# EAGLE design POE_RS-485 (EAGLE 6.4)
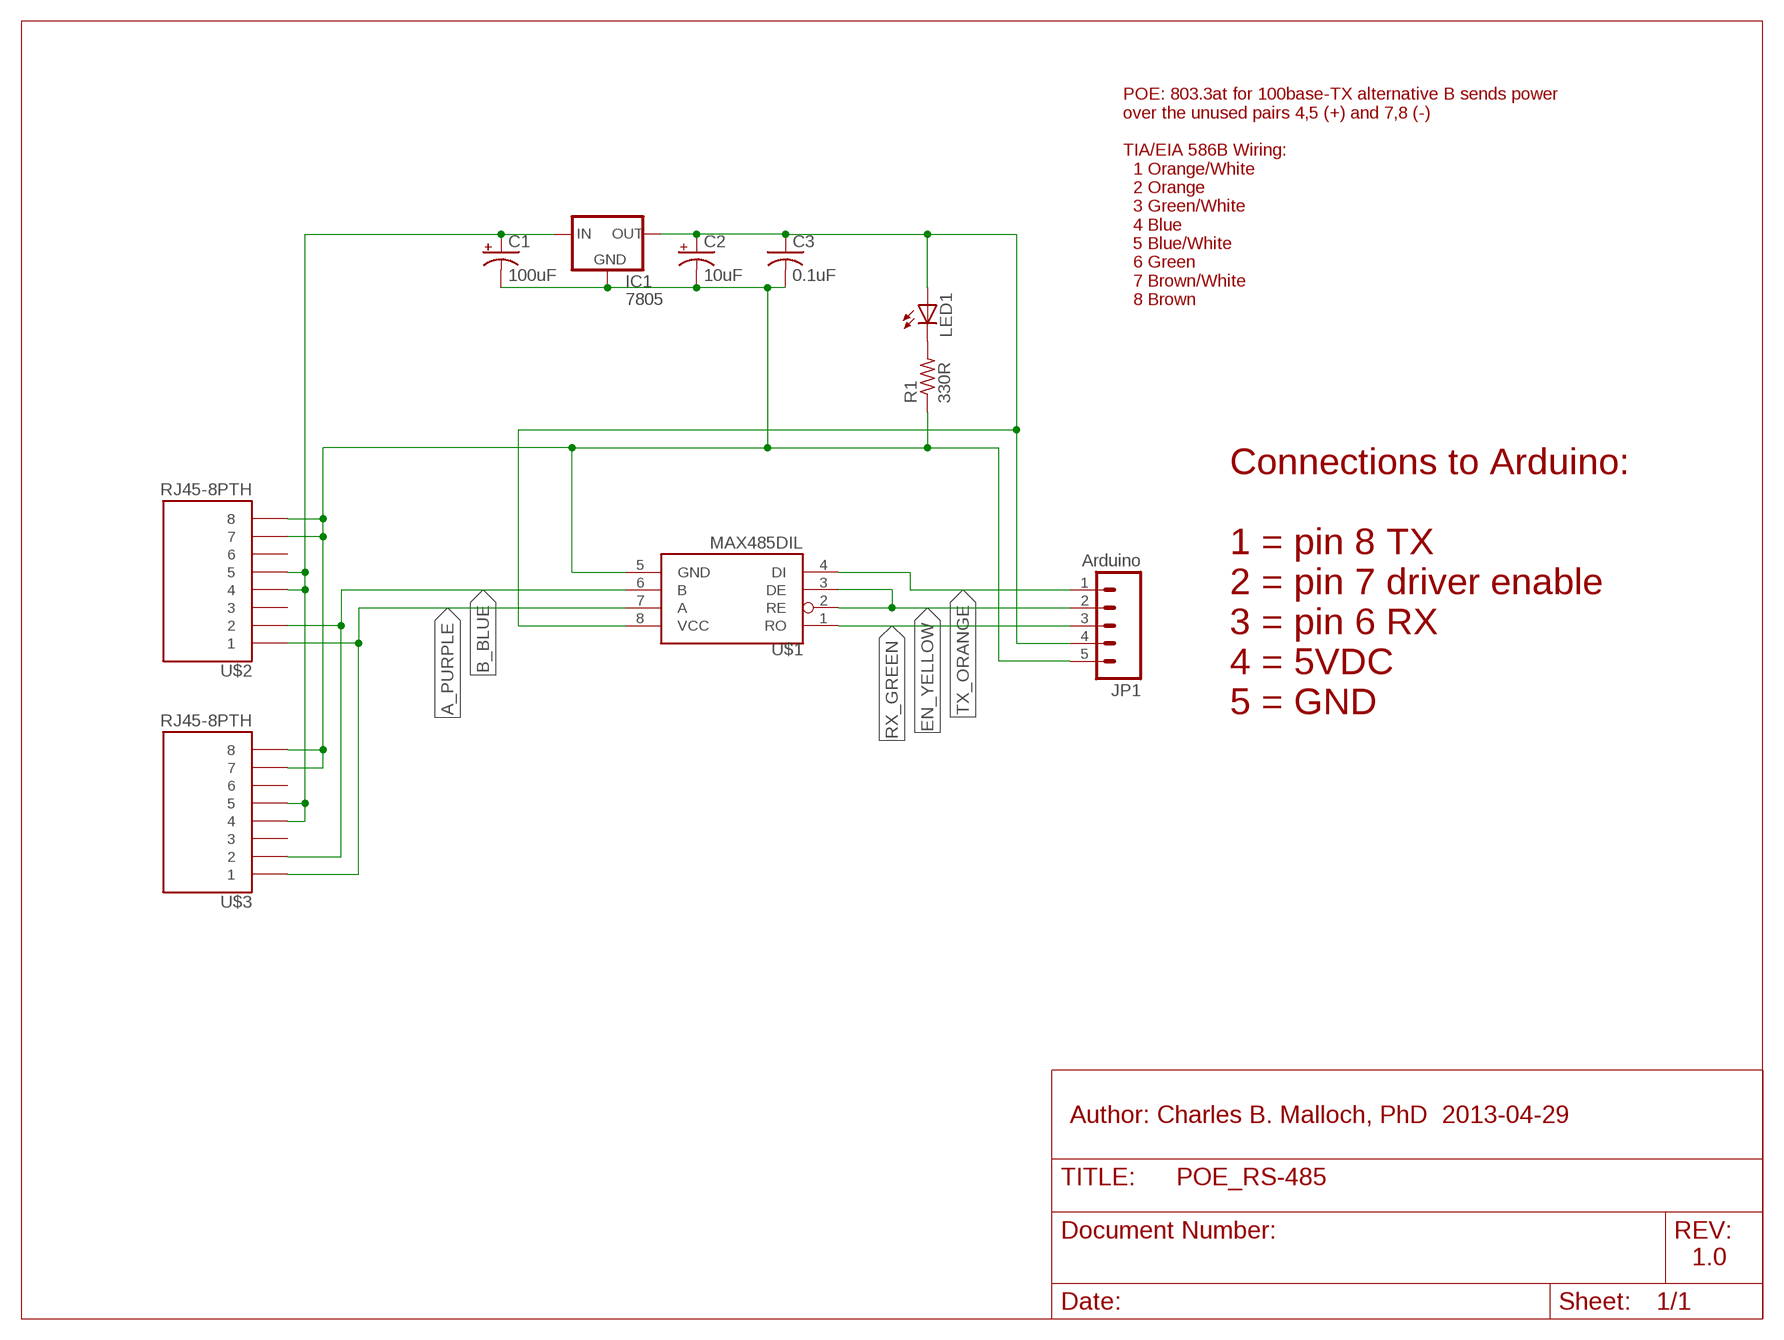
[diagram p0: schematic, sheet 1]

## Parts
C1  100uF  CPOL-USTT2D7  [TT2D7]
C2  10uF  CPOL-USE1.8-4  [E1,8-4]
C3  0.1uF  C-US025-025X050  [C025-025X050]
IC1  7805  V_REG_78XX-TO-220  [TO-220-ALT]
JP1  Arduino  M05LOCK_LONGPADS  [1X05_LOCK_LONGPADS]
LED1  LED3MM  [LED3MM]
R1  330R  R-US_0204/7  [0204/7]
U$1  MAX485DIL  [DIL08]
U$2  RJ45-8PTH  [RJ45-8]
U$3  RJ45-8PTH  [RJ45-8]

## Nets
A_PURPLE: U$1.7(A) U$2.1 U$3.1
B_BLUE: U$1.6(B) U$2.2 U$3.2
EN_YELLOW: JP1.2 U$1.2(RE) U$1.3(DE)
GND [POWER]: C1.- C2.- C3.2 IC1.GND JP1.5 R1.1 U$1.5(GND) U$2.7 U$2.8 U$3.7 U$3.8
N$1: LED1.K(C) R1.2
PWR [POWER]: C2.+ C3.1 IC1.OUT JP1.4 LED1.A U$1.8(VCC)
RX_GREEN: JP1.3 U$1.1(RO)
TX_ORANGE: JP1.1 U$1.4(DI)
VIN [POWER]: C1.+ IC1.IN U$2.4 U$2.5 U$3.4 U$3.5
Unconnected: U$2.3 U$2.6 U$3.3 U$3.6

## Notes on the sheet
- POE: 803.3at for 100base-TX alternative B sends power 
  over the unused pairs 4,5 (+) and 7,8 (-)
  
  TIA/EIA 586B Wiring:
    1 Orange/White
    2 Orange
    3 Green/White
    4 Blue
    5 Blue/White
    6 Green
    7 Brown/White
    8 Brown
- Connections to Arduino:
  
  1 = pin 8 TX
  2 = pin 7 driver enable
  3 = pin 6 RX
  4 = 5VDC
  5 = GND
- Author: Charles B. Malloch, PhD  2013-04-29
- 1.0

## Library data of the parts
C1 C2 = adafruit:CPOL-US: POLARIZED CAPACITOR, American symbol
C3 = adafruit:C-US: CAPACITOR, American symbol
IC1 = SparkFun-PowerIC:V_REG_78XX: Voltage Regulator Standard 7805 5V regulator. IGO (Input Ground Output). Spark Fun Electronics SKU : COM-00107
JP1 = SparkFun-Connectors:M05: Header 5 Standard 5-pin 0.1" header. Use with straight break away headers (SKU : PRT-00116), right angle break away headers (PRT-00553), swiss pins (PRT-00743), machine pins (PRT-00117), and female headers (PRT-00115). Molex polarized connector foot print use with SKU : PRT-08230 with associated crimp pins and housings.
LED1 = led:LED: LED OSRAM: - CHIPLED LG R971, LG N971, LY N971, LG Q971, LY Q971, LO R971, LY R971 LH N974, LH R974 LS Q976, LO Q976, LY Q976 LO Q996 - Hyper CHIPLED LW Q18S LB Q993, LB Q99A, LB R99A - SideLED LS A670, LO A670, LY A670, LG A670, LP A670 LB A673, LV A673, LT A673, LW A673 LH A674 LY A675 LS A676, LA A676, LO A676, LY A676, LW A676 LS A679, LY A679, LG A679 - Hyper Micro SIDELED® LS Y876, LA Y876, LO Y876, LY Y876 LT Y87S - SmartLED LW L88C, LW L88S LB L89C, LB L89S, LG L890 LS L89K, LO L89K, LY L89K LS L896, LA L896, LO L896, LY L896 - TOPLED LS T670, LO T670, LY T670, LG T670, LP T670 LSG T670, LSP T670, LSY T670, LOP T670, LYG T670 LG T671, LOG T671, LSG T671 LB T673, LV T673, LT T673, LW T673 LH T674 LS T676, LA T676, LO T676, LY T676, LB T676, LH T676, LSB T676, LW T676 LB T67C, LV T67C, LT T67C, LS T67K, LO T67K, LY T67K, LW E67C LS E67B, LA E67B, LO E67B, LY E67B, LB E67C, LV E67C, LT E67C LW T67C LS T679, LY T679, LG T679 LS T770, LO T770, LY T770, LG T770, LP T770 LB T773, LV T773, LT T773, LW T773 LH T774 LS E675, LA E675, LY E675, LS T675 LS T776, LA T776, LO T776, LY T776, LB T776 LHGB T686 LT T68C, LB T68C - Hyper Mini TOPLED® LB M676 - Mini TOPLED Santana® LG M470 LS M47K, LO M47K, LY M47K Source: http://www.osram.convergy.de LUXEON: - LUMILED® LXK2-PW12-R00, LXK2-PW12-S00, LXK2-PW14-U00, LXK2-PW14-V00 LXK2-PM12-R00, LXK2-PM12-S00, LXK2-PM14-U00 LXK2-PE12-Q00, LXK2-PE12-R00, LXK2-PE12-S00, LXK2-PE14-T00, LXK2-PE14-U00 LXK2-PB12-K00, LXK2-PB12-L00, LXK2-PB12-M00, LXK2-PB14-N00, LXK2-PB14-P00, LXK2-PB14-Q00 LXK2-PR12-L00, LXK2-PR12-M00, LXK2-PR14-Q00, LXK2-PR14-R00 LXK2-PD12-Q00, LXK2-PD12-R00, LXK2-PD12-S00 LXK2-PH12-R00, LXK2-PH12-S00 LXK2-PL12-P00, LXK2-PL12-Q00, LXK2-PL12-R00 Source: www.luxeon.com KINGBRIGHT: KA-3528ASYC Source: www.kingbright.com
R1 = resistor:R-US_: RESISTOR, American symbol
U$1 = SparkFun-DigitalIC:MAX485: RS-485 transceiver
U$2 U$3 = SparkFun-Connectors:RJ45-8: RJ45 Jack Simple RJ45, 8-pin connection - connector for common Cat5, Cat5e, and Cat6 Ethernet cables. Footprint not yet proven in production. Connector sku is PRT-00643; Breakout PCB sku is BOB-00716.

## Net classes
1 POWER: width 0.61 mm, clearance 0.305 mm

## Board
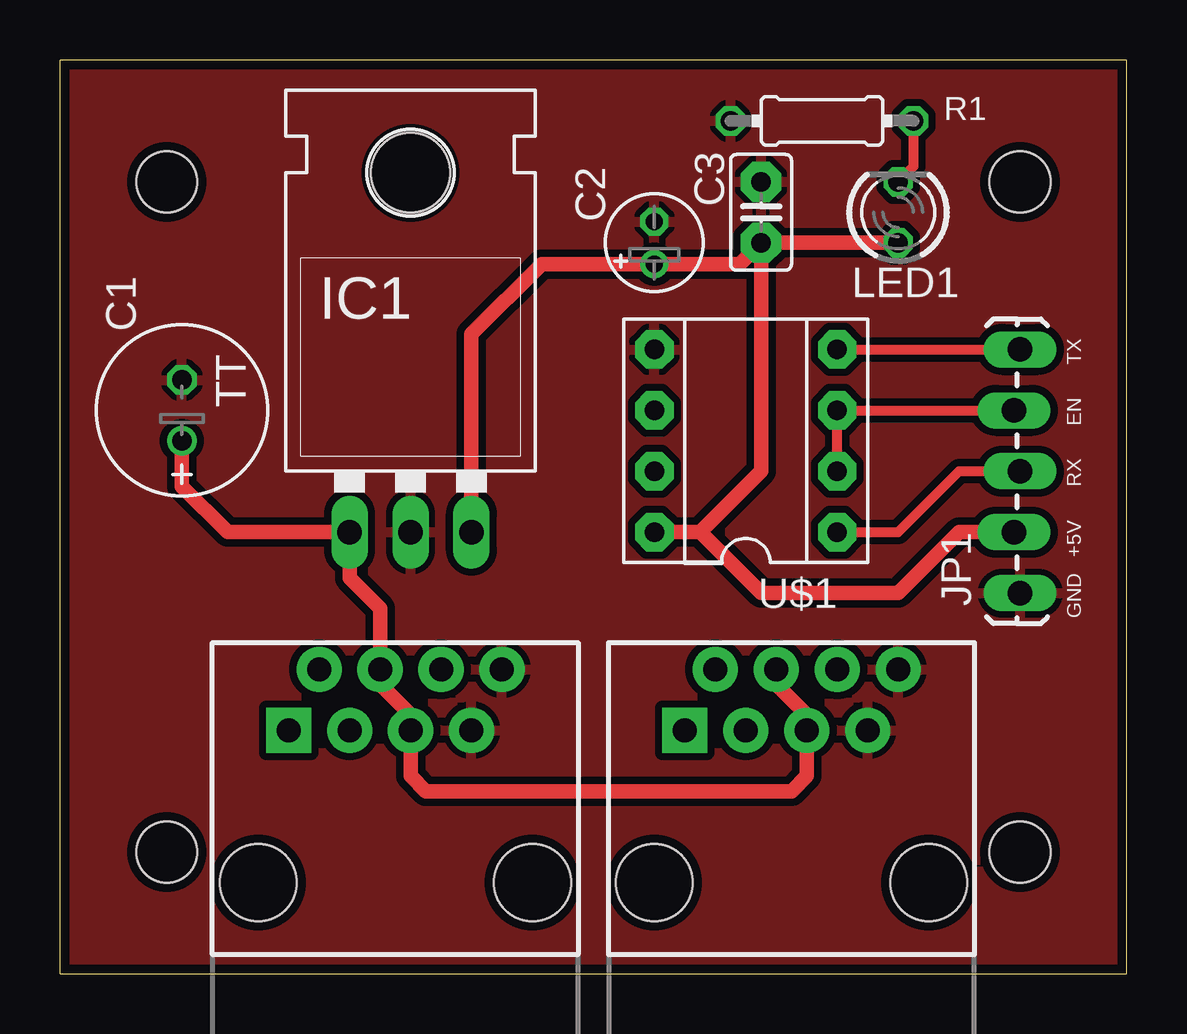
[diagram p1: board, top side]
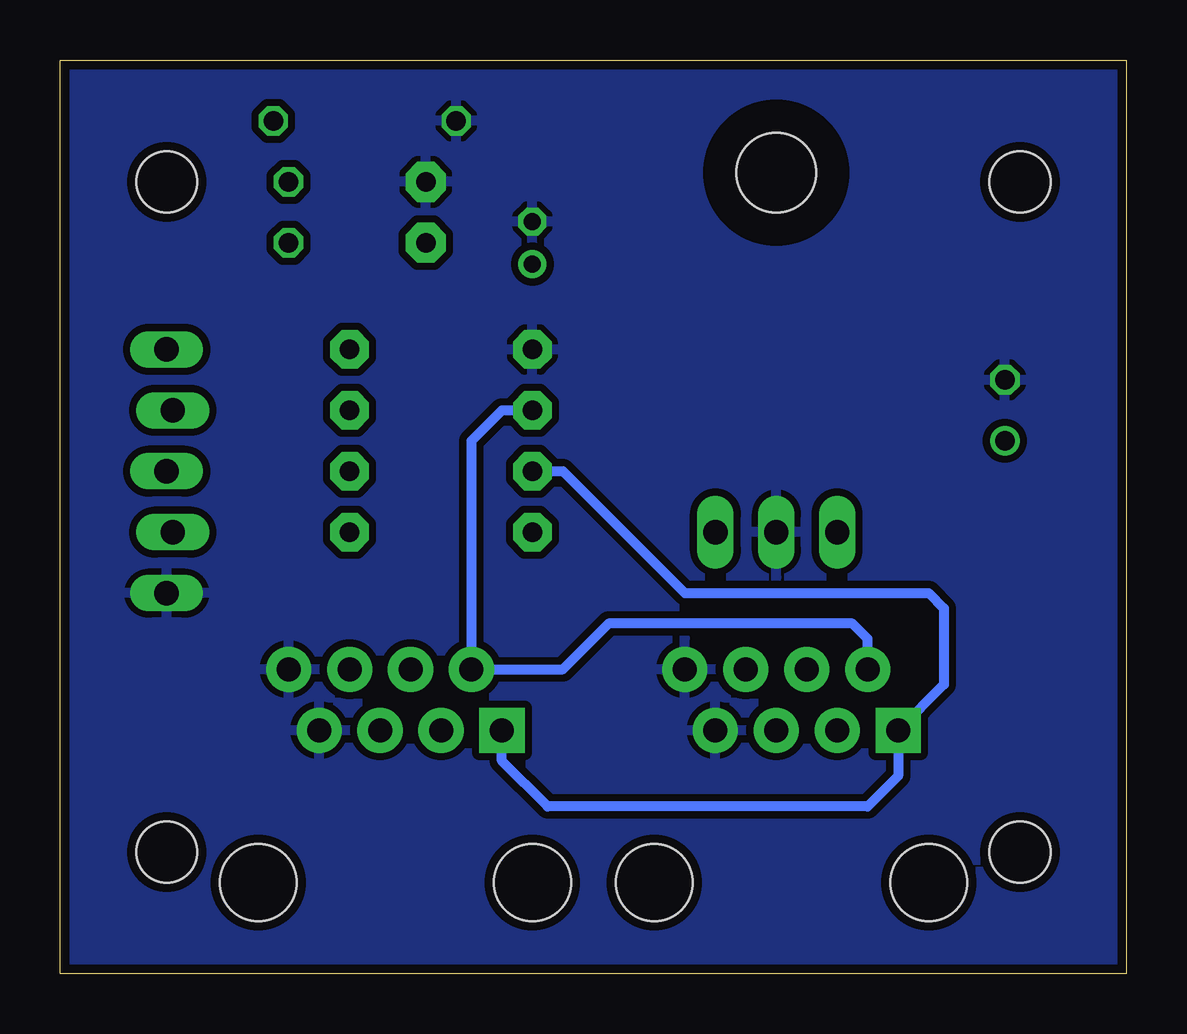
[diagram p2: board, bottom side, seen from below]

Size 44.45 x 38.1 mm. Coordinates in mm from the lower left corner, seen from the top.
Outline: 0,0 44.45,0 44.45,38.1 0,38.1 0,0
Copper layers (1*16): Top 0.0356mm / dielectric 1.5011mm / Bottom 0.0356mm
Design rules "LaenPCBOrder": minimum track width 6mil, minimum drill 13mil, track to track 6mil, track to pad 6mil, pad to pad 6mil, via to via 6mil, smd to smd 6mil, copper to edge 15mil, drill to drill 6mil, minimum pad ring 7mil, minimum via ring 7mil, stop-mask expansion 4mil, vias tented up to drill 0mil, thermal gap 10mil
Holes 2.54 mm at 4.45,5.08 40.01,5.08 40.01,33.02 4.45,33.02

### Footprints (pad centres in the part's own frame; a part is rotated, then mirrored left to right if it is on the bottom)
TT2D7 = drill 0.813: + -1.27,0 | drill 0.813 octagon: - 1.27,0
E1,8-4 = drill 0.711 pad 1.168: + -0.889,0 | drill 0.711 pad 1.168 octagon: - 0.889,0
C025-025X050 = drill 0.813 pad 1.676 octagon: 1 -1.27,0; 2 1.27,0
TO-220-ALT = drill 1.016 long: GND 0,-3.81; IN -2.54,-3.81; OUT 2.54,-3.81 | hole 3.302: 0,11.176
1X05_LOCK_LONGPADS = drill 1.016 long: 1 0,0; 2 2.54,-0.254; 3 5.08,0; 4 7.62,-0.254; 5 10.16,0
LED3MM = drill 0.813 octagon: A -1.27,0; K 1.27,0
0204/7 = drill 0.813 octagon: 1 -3.81,0; 2 3.81,0
DIL08 = drill 0.813 pad 1.6 octagon: 1 -3.81,-3.81; 2 -1.27,-3.81; 3 1.27,-3.81; 4 3.81,-3.81; 5 3.81,3.81; 6 1.27,3.81; 7 -1.27,3.81; 8 -3.81,3.81
RJ45-8 = drill 1 pad 1.88 square: 1 -4.445,6.35 | drill 1 pad 1.88: 2 -3.175,8.89; 3 -1.905,6.35; 4 -0.635,8.89; 5 0.635,6.35; 6 1.905,8.89; 7 3.175,6.35; 8 4.445,8.89 | hole 3.2: -5.715,0; 5.715,0

### Placement (x,y rotation side)
C1  5.08,23.5 90 top
C2  24.77,30.48 90 top
C3  29.21,31.75 90 top
IC1  14.61,22.23 0 top
JP1  40.01,26.04 270 top
LED1  34.92,31.75 90 top
R1  31.75,35.56 0 top
U$1  28.57,22.23 90 top
U$2  13.97,3.81 0 top
U$3  30.48,3.81 0 top

### Tracks (layer width: path | path; a pad name or v marks a point on that pad's centre or on a via)
A_PURPLE
  Bottom 0.406: U$3.1 26.04,8.89 24.13,6.99 10.79,6.99 9.53,8.26 U$2.1 7.62,12.06 7.62,15.24 8.26,15.88 18.41,15.88 23.5,20.95 U$1.7
B_BLUE
  Bottom 0.406: U$2.2 10.79,13.97 11.43,14.61 21.59,14.61 23.5,12.7 U$3.2 27.3,22.23 26.04,23.5 U$1.6
EN_YELLOW
  Top 0.406: U$1.2 U$1.3 JP1.2
GND
  pour Top: 0,0 0,38.1 44.45,38.1 44.45,0
  pour Bottom: 0,0 0,38.1 44.45,38.1 44.45,0
N$1
  Top 0.406: R1.2 35.56,33.66 LED1.K
PWR
  Top 0.61: IC1.OUT 17.14,26.67 20.07,29.59 C2.+ 28.32,29.59 C3.1 | LED1.A C3.1 | U$1.8 26.67,18.41 | 26.67,18.41 29.21,20.95 C3.1 | JP1.4 37.47,18.41 34.92,15.88 29.21,15.88 26.67,18.41
RX_GREEN
  Top 0.406: JP1.3 37.47,20.95 34.92,18.41 U$1.1
TX_ORANGE
  Top 0.406: U$1.4 JP1.1
VIN
  Top 0.61: U$3.4 29.84,12.06 31.11,10.79 U$3.5 31.11,8.26 30.48,7.62 15.24,7.62 14.61,8.26 U$2.5 14.61,10.79 13.34,12.06 U$2.4 13.34,15.24 12.06,16.51 IC1.IN 6.99,18.41 5.08,20.32 C1.+

### Text on the board
tNames: TX | EN | RX | +5V | GND
bValues: POE_RS-485 v1.0 | cbm Electronics